# EasyEDA schematic AUGIS_Switch_Board.json
TITLE: AUGIS_Swtch_Board; REV: 1.0; Date: 2021-02-28; Sheet: 1/1; Company: BFH
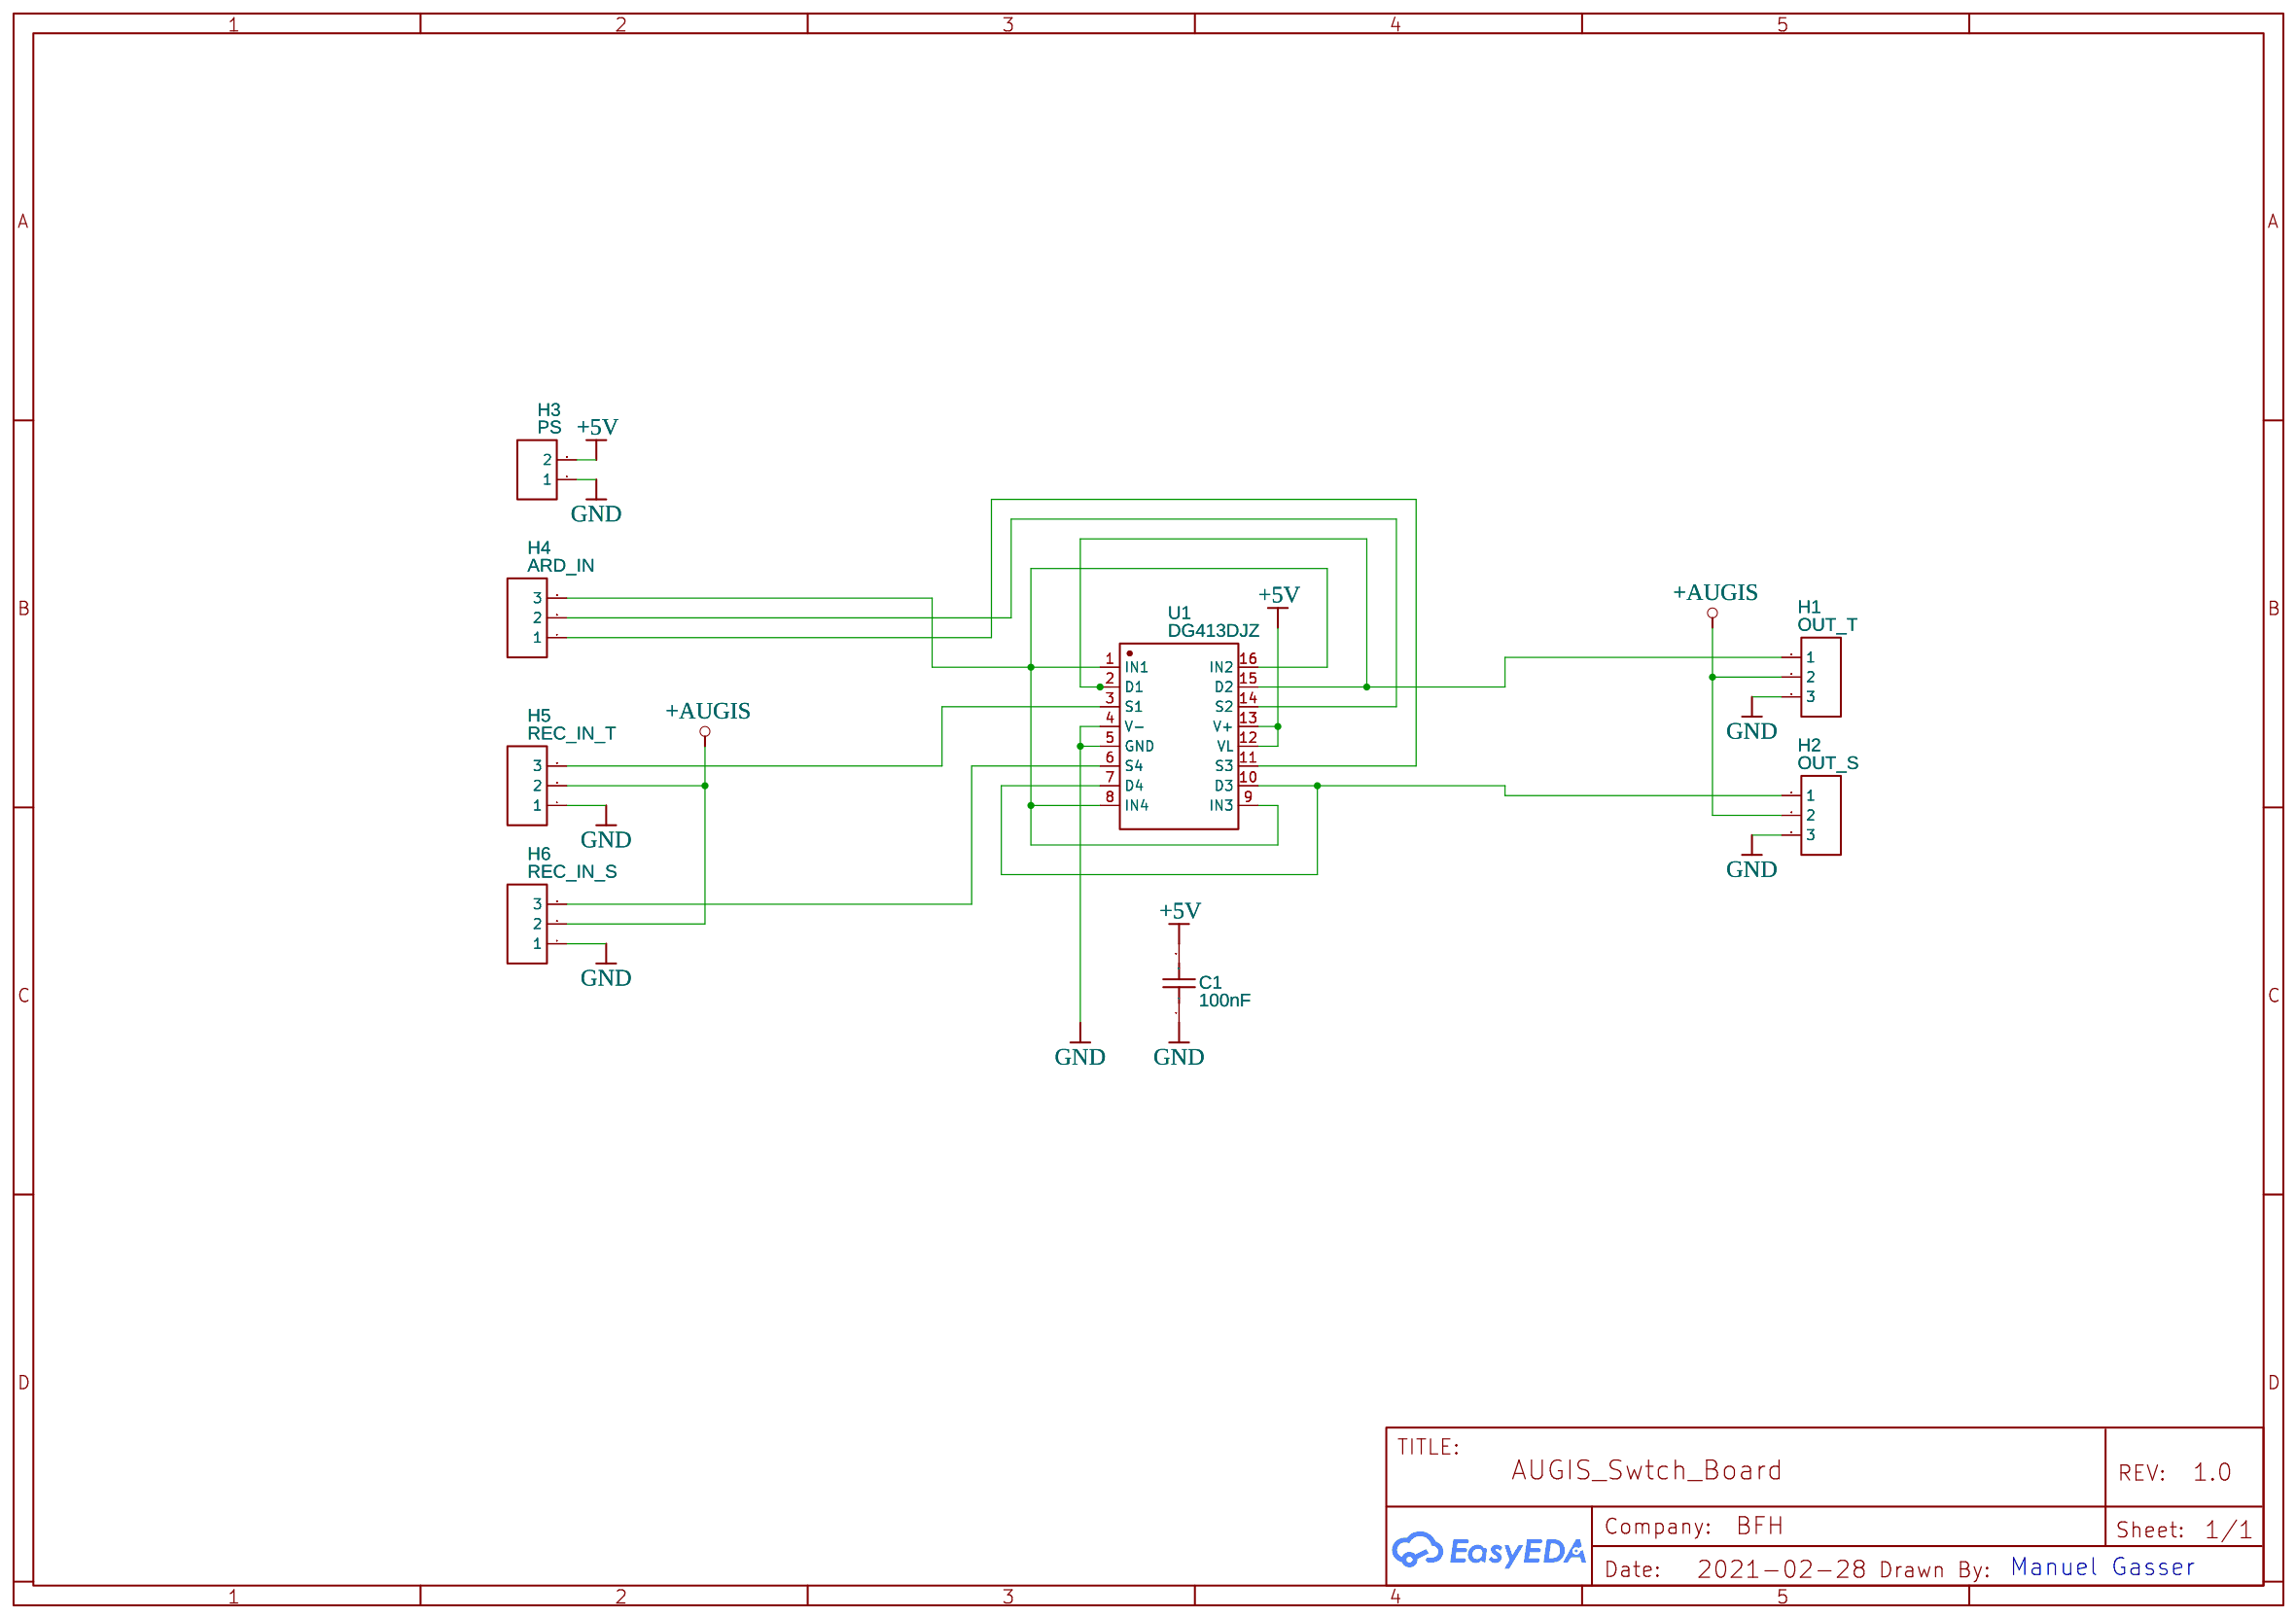
[diagram p0: schematic sheet]

## Parts
C1  100nF  [C0603]
H1  OUT_T  [HDR-F-2.54_1X3]
H2  OUT_S  [HDR-F-2.54_1X3]
H3  PS  [HDR-F-2.54_1X2]
H4  ARD_IN  [HDR-F-2.54_1X3]
H5  REC_IN_T  [HDR-F-2.54_1X3]
H6  REC_IN_S  [HDR-F-2.54_1X3]
U1  DG413DJZ  [DIP16]

## Library data of the parts
C1 = C_0603_US: Contributor: LCEDA_Lib
H1 H2 H4-H6 = HDR-F-2.54_1x3: Supplier Part: C146690; Supplier: LCSC; Contributor: LCEDA_Lib
H3 = HDR-F-2.54_1x2: Supplier Part: C49661; Supplier: LCSC; Contributor: LCEDA_Lib
U1 = DG413DJZ

## Nets
+5V: C1.2 H3.2 U1.12(VL) U1.13(V+)
GND: C1.1 H1.3 H2.3 H3.1 H5.1 H6.1 U1.4(V-) U1.5(GND)
+AUGIS: H1.2 H2.2 H5.2 H6.2
Net-(H1-1): H1.1 U1.2(D1) U1.15(D2)
Net-(H2-1): H2.1 U1.7(D4) U1.10(D3)
Net-(H4-1): H4.1 U1.11(S3)
Net-(H4-2): H4.2 U1.14(S2)
Net-(H4-3): H4.3 U1.1(IN1) U1.8(IN4) U1.9(IN3) U1.16(IN2)
Net-(H5-3): H5.3 U1.3(S1)
Net-(H6-3): H6.3 U1.6(S4)

## Notes on the sheet
- Manuel Gasser
